# EAGLE schematic task1_digital (EAGLE 9.6.2)
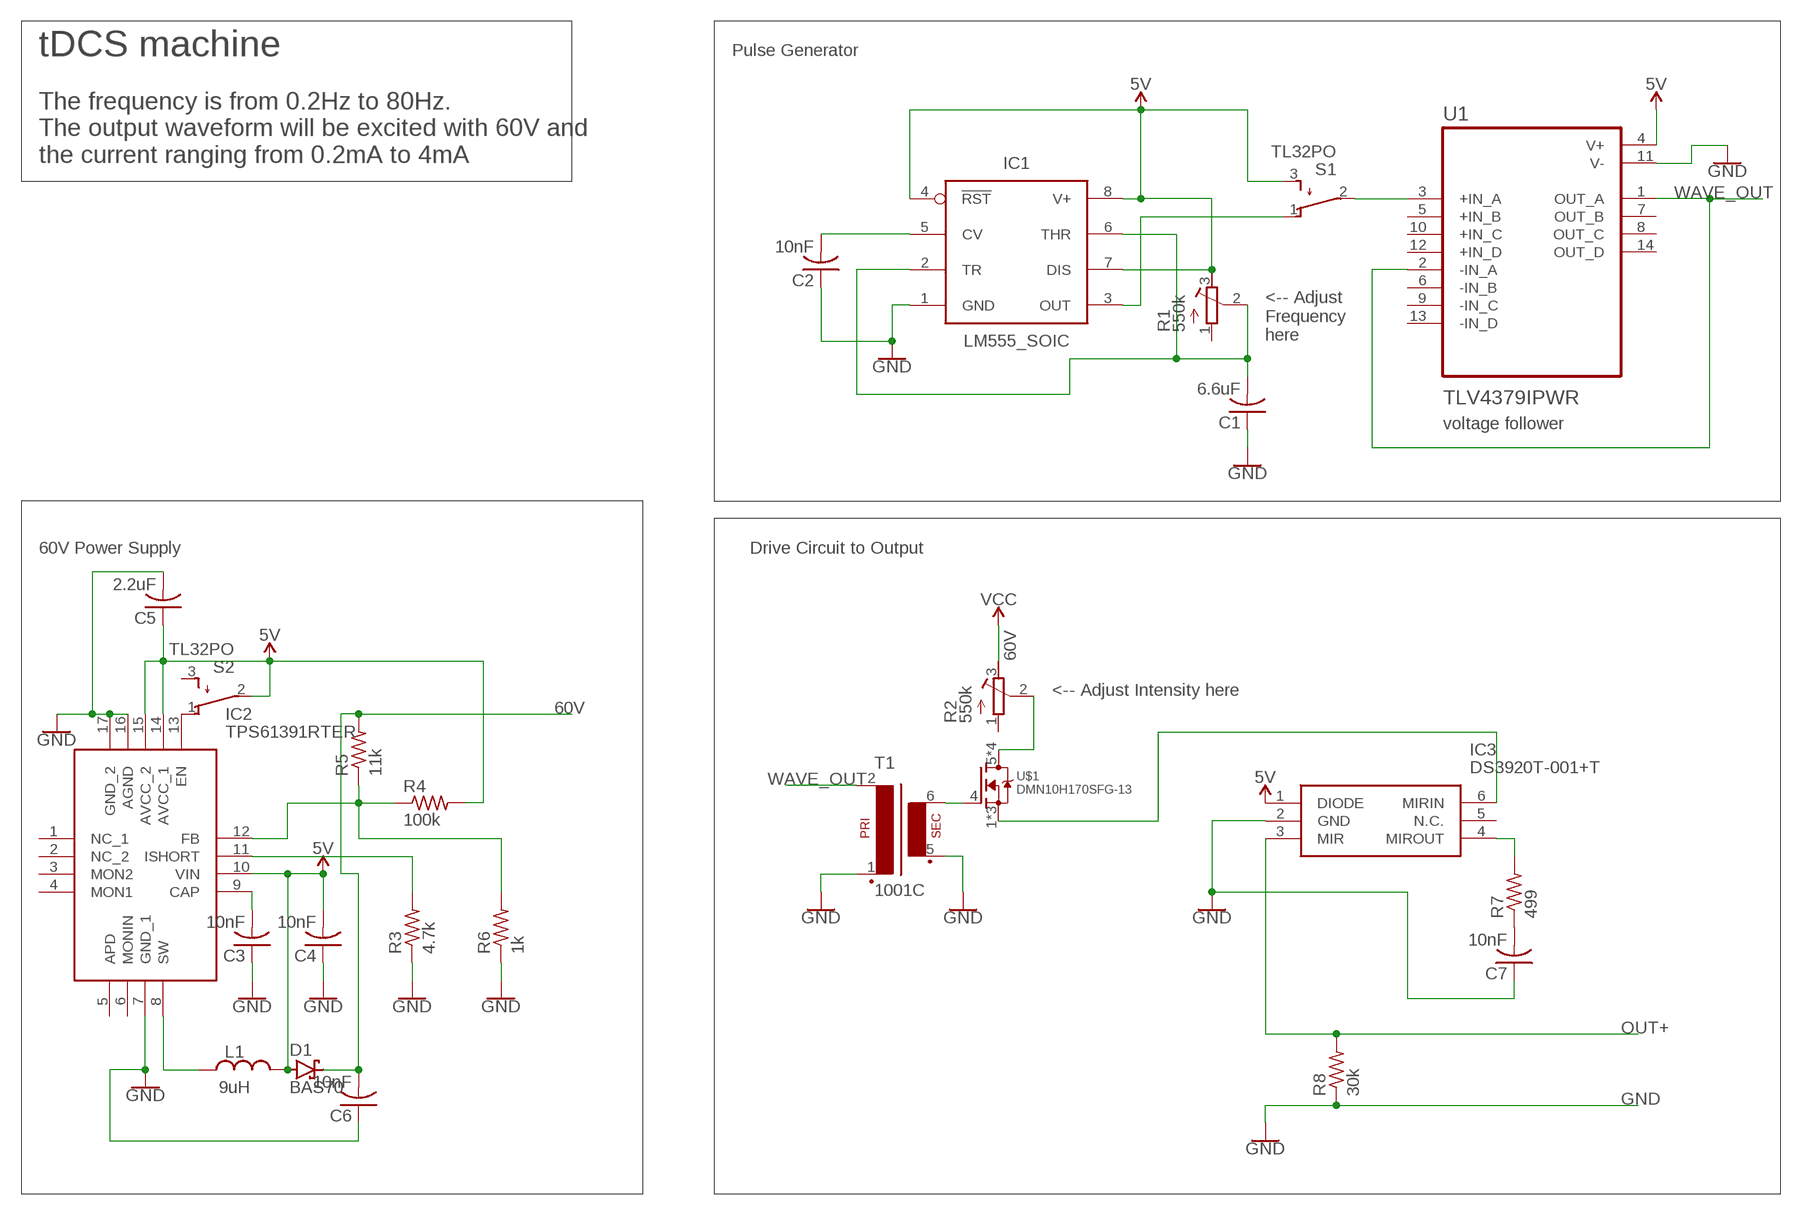
[diagram p0: schematic, sheet 1]

## Parts
C1  6.6uF  C-USC0805  [C0805]
C2  10nF  C-USC0805  [C0805]
C3  10nF  C-USC0805  [C0805]
C4  10nF  C-USC0805  [C0805]
C5  2.2uF  C-USC0805  [C0805]
C6  10nF  C-USC0805  [C0805]
C7  10nF  C-USC0805  [C0805]
D1  BAS70  [SOT23]
IC1  LM555_SOIC  [SOIC127P599X175-8N]
IC2  TPS61391RTER  [QFN50P300X300X80-17N]
IC3  DS3920T-001+T  [SOT95P280X145-6N]
L1  9uH  L_CHIP-1206(3216-METRIC)  [INDC3216X190]
R1  550k  R-TRIMM4G/J  [RTRIM4G/J]
R2  550k  R-TRIMM4G/J  [RTRIM4G/J]
R3  4.7k  R-US_R0805  [R0805]
R4  100k  R-US_R0805  [R0805]
R5  11k  R-US_R0805  [R0805]
R6  1k  R-US_R0805  [R0805]
R7  499  R-US_R0805  [R0805]
R8  30k  R-US_R0805  [R0805]
S1  TL32PO  [TL3XPO]
S2  TL32PO  [TL3XPO]
T1  1001C  [1001]
U1  TLV4379IPWR  [SOP65P640X120-14N]
U$1  DMN10H170SFG-13  [TRANS_DMP3017SFGQ-7]

## Nets
5V: C4.2 C5.1 D1.1(A) IC1.4(!RST) IC1.7(DIS) IC1.8(V+) IC2.10(VIN) IC2.14(AVCC_1) IC2.15(AVCC_2) IC3.1(DIODE) L1.2 R1.3(E) R4.2 S1.3(S) S2.2(P) U1.4(V+)
60V: C6.2 D1.3(C) R2.3(E) R5.2 ; supply symbol labelled VCC
GND: C1.1 C2.1 C3.1 C4.1 C5.2 C6.1 C7.1 IC1.1(GND) IC2.7(GND_1) IC2.16(AGND) IC2.17(GND_2) IC3.2(GND) R3.1 R6.1 R8.1 T1.1 T1.5(S1) U1.11(V-)
N$1: C2.2 IC1.5(CV)
N$2: C1.2 IC1.2(TR) IC1.6(THR) R1.2(S)
N$3: IC1.3(OUT) S1.1(O)
N$4: S1.2(P) U1.3(+IN_A)
N$5: T1.6(S2) U$1.4(G)
N$6: R2.2(S) U$1.5(D) U$1.6(D) U$1.7(D) U$1.8(D)
N$7: IC2.13(EN) S2.1(O)
N$8: C3.2 IC2.9(CAP)
N$9: IC2.11(ISHORT) R3.2
N$10: IC2.8(SW) L1.1
N$11: IC2.12(FB) R4.1 R5.1 R6.2
N$12: IC3.4(MIROUT) R7.2
N$13: IC3.6(MIRIN) U$1.1(S) U$1.2(S) U$1.3(S)
N$14: C7.2 R7.1
OUT+: IC3.3(MIR) R8.2
WAVE_OUT: T1.2 U1.1(OUT_A) U1.2(-IN_A)
Unconnected: IC2.1(NC_1) IC2.2(NC_2) IC2.3(MON2) IC2.4(MON1) IC2.5(APD) IC2.6(MONIN) IC3.5(N.C.) R1.1(A) R2.1(A) S2.3(S) U1.5(+IN_B) U1.6(-IN_B) U1.7(OUT_B) U1.8(OUT_C) U1.9(-IN_C) U1.10(+IN_C) U1.12(+IN_D) U1.13(-IN_D) U1.14(OUT_D)

## Notes on the sheet
- tDCS machine | Pulse Generator
- The frequency is from 0.2Hz to 80Hz.
  The output waveform will be excited with 60V and
  the current ranging from 0.2mA to 4mA
- <-- Adjust
  Frequency
  here
- voltage follower
- 60V Power Supply | Drive Circuit to Output
- <-- Adjust Intensity here

## Library data of the parts
C1-C7 = adafruit:C-US: CAPACITOR, American symbol
D1 = diode:BAS70: Silicon Schottky Diodes General-purpose diode for high-speed switching
IC1 = IC_Clock-Timing:*555: TIMER 555 General purpose precision timers NE555 : Texas Datasheet <http://www.ti.com/general/docs/suppproductinfo.tsp?distId=10&gotoUrl=http%3A%2F%2Fwww.ti.com%2Flit%2Fgpn%2Fne555>, Diodes Incorporated Datasheet <https://www.diodes.com/assets/Datasheets/NE555_SA555_NA555.pdf> LM555 Datasheet <http://www.ti.com/general/docs/suppproductinfo.tsp?distId=10&gotoUrl=http%3A%2F%2Fwww.ti.com%2Flit%2Fgpn%2Flm555> LMC555 Datasheet <http://www.ti.com/general/docs/suppproductinfo.tsp?distId=10&gotoUrl=http%3A%2F%2Fwww.ti.com%2Flit%2Fgpn%2Flmc555> ICM7555 : Maxim Integrated Datasheet <https://datasheets.maximintegrated.com/en/ds/ICM7555-ICM7556.pdf>, Renesas Electronics America Inc Datasheet <https://www.renesas.com/en-us/www/doc/datasheet/icm7555-56.pdf>; CATEGORY: IC_Clock-Timing; CURRENT-SUPPLY: 10mA; DESCRIPTION: IC OSC SGL TIMER 100KHZ 8-SOIC; FREQUENCY: 100kHz; MANUFACTURER: Texas Instruments; MPN: LM555CM/NOPB; OPERATING_TEMP: 0°C to 70°C; PART_STATUS: Active; ROHS_COMPLIANT: ROHS3 Compliant; SUB-CATEGORY: Timer
IC2 = TPS61391RTER:TPS61391RTER: Switching Voltage Regulators 85-VOUT boost converter 16-WQFN -40 to 125 Source: Datasheet <https://www.ti.com/general/docs/suppproductinfo.tsp?distId=10&gotoUrl=http://www.ti.com/lit/gpn/tps61391>; ARROW_PART_NUMBER: TPS61391RTER; ARROW_PRICE-STOCK: https://www.arrow.com/en/products/tps61391rter/texas-instruments?region=nac; DESCRIPTION: Switching Voltage Regulators 85-VOUT boost converter 16-WQFN -40 to 125; HEIGHT: 0.8mm; MANUFACTURER_NAME: Texas Instruments; MANUFACTURER_PART_NUMBER: TPS61391RTER; MOUSER_PART_NUMBER: 595-TPS61391RTER; MOUSER_PRICE-STOCK: https://www.mouser.co.uk/ProductDetail/Texas-Instruments/TPS61391RTER?qs=wnTfsH77Xs7Q4UMmH2F4rA%3D%3D
IC3 = SamacSys_Parts:DS3920T-001+T: Current & Power Monitors & Regulators Fast Current Mirror Source: Datasheet <https://componentsearchengine.com/Datasheets/1/DS3920T-001 T.pdf>; DESCRIPTION: Current & Power Monitors & Regulators Fast Current Mirror; HEIGHT: 1.45mm; MANUFACTURER_NAME: Maxim Integrated; MANUFACTURER_PART_NUMBER: DS3920T-001+T; MOUSER_PART_NUMBER: 700-DS3920T-001+T; MOUSER_PRICE-STOCK: https://www.mouser.com/Search/Refine.aspx?Keyword=700-DS3920T-001%2BT
L1 = Inductor:L: Inductor Fixed - Generic; CATEGORY: Inductor; SUB-CATEGORY: Fixed
R1 R2 = rcl:R-TRIMM: Trimm resistor; SPICEMODEL: X; SPICEPREFIXL: POT
R3-R8 = adafruit:R-US_: RESISTOR, American symbol
S1 S2 = switch:TL32PO: TINY SWITCH ON - MOM Source: http://www2.produktinfo.conrad.com/datenblaetter/700000-724999/705152-da-01-de-Subminiaturschalter_TL_36YO.pdf
T1 = 1001C:1001C: Check prices <https://pricing.snapeda.com/parts/1001C/Murata%20Power/view-part?ref=eda>; AVAILABILITY: In Stock; DESCRIPTION: 3mH Pulse Transformer 1:1 Through Hole; MF: Murata Power; MP: 1001C; PACKAGE: UDFN-10 Murata; PRICE: None; PURCHASE-URL: https://pricing.snapeda.com/search/part/1001C/?ref=eda
U1 = TLV4379IPWR:TLV4379IPWR: None Check prices <https://pricing.snapeda.com/parts/TLV4379IPWR/Texas%20Instruments/view-part?ref=eda>; AVAILABILITY: In Stock; DESCRIPTION: Low-Voltage, 4-uA, Rail-to-Rail I/O Operational Amplifier for Cost-Sensitive Systems 14-TSSOP -40 to 125; MF: Texas Instruments; MP: TLV4379IPWR; PACKAGE: TSSOP-14 Texas Instruments; PRICE: None; PURCHASE-URL: https://pricing.snapeda.com/search/part/TLV4379IPWR/?ref=eda
U$1 = TRANS_DMP3017SFGQ-7:DMN10H170SFG-13